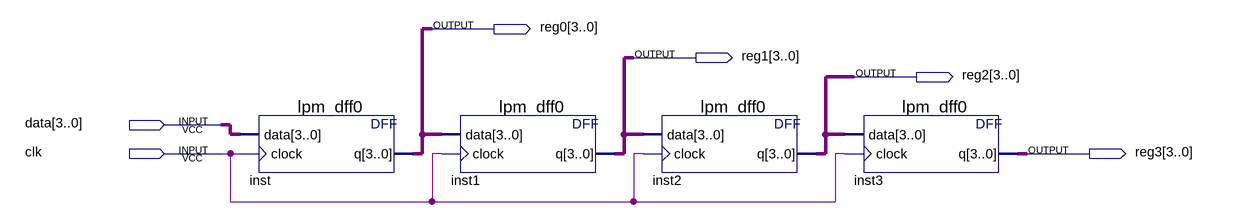
[diagram p0: schematic sheet]
// Quartus schematic Registers.bdf as structural Verilog: 4 symbols, 6 pins
module Registers (
  input  [3:0] data,
  input  clk,
  output [3:0] reg0,
  output [3:0] reg1,
  output [3:0] reg2,
  output [3:0] reg3
);

  lpm_dff0 inst (.data(data), .clock(clk), .q(reg0));
  lpm_dff0 inst1 (.data(reg0), .clock(clk), .q(reg1));
  lpm_dff0 inst2 (.data(reg1), .clock(clk), .q(reg2));
  lpm_dff0 inst3 (.data(reg2), .clock(clk), .q(reg3));
endmodule
